# Altium project SENSOR.PrjPcb
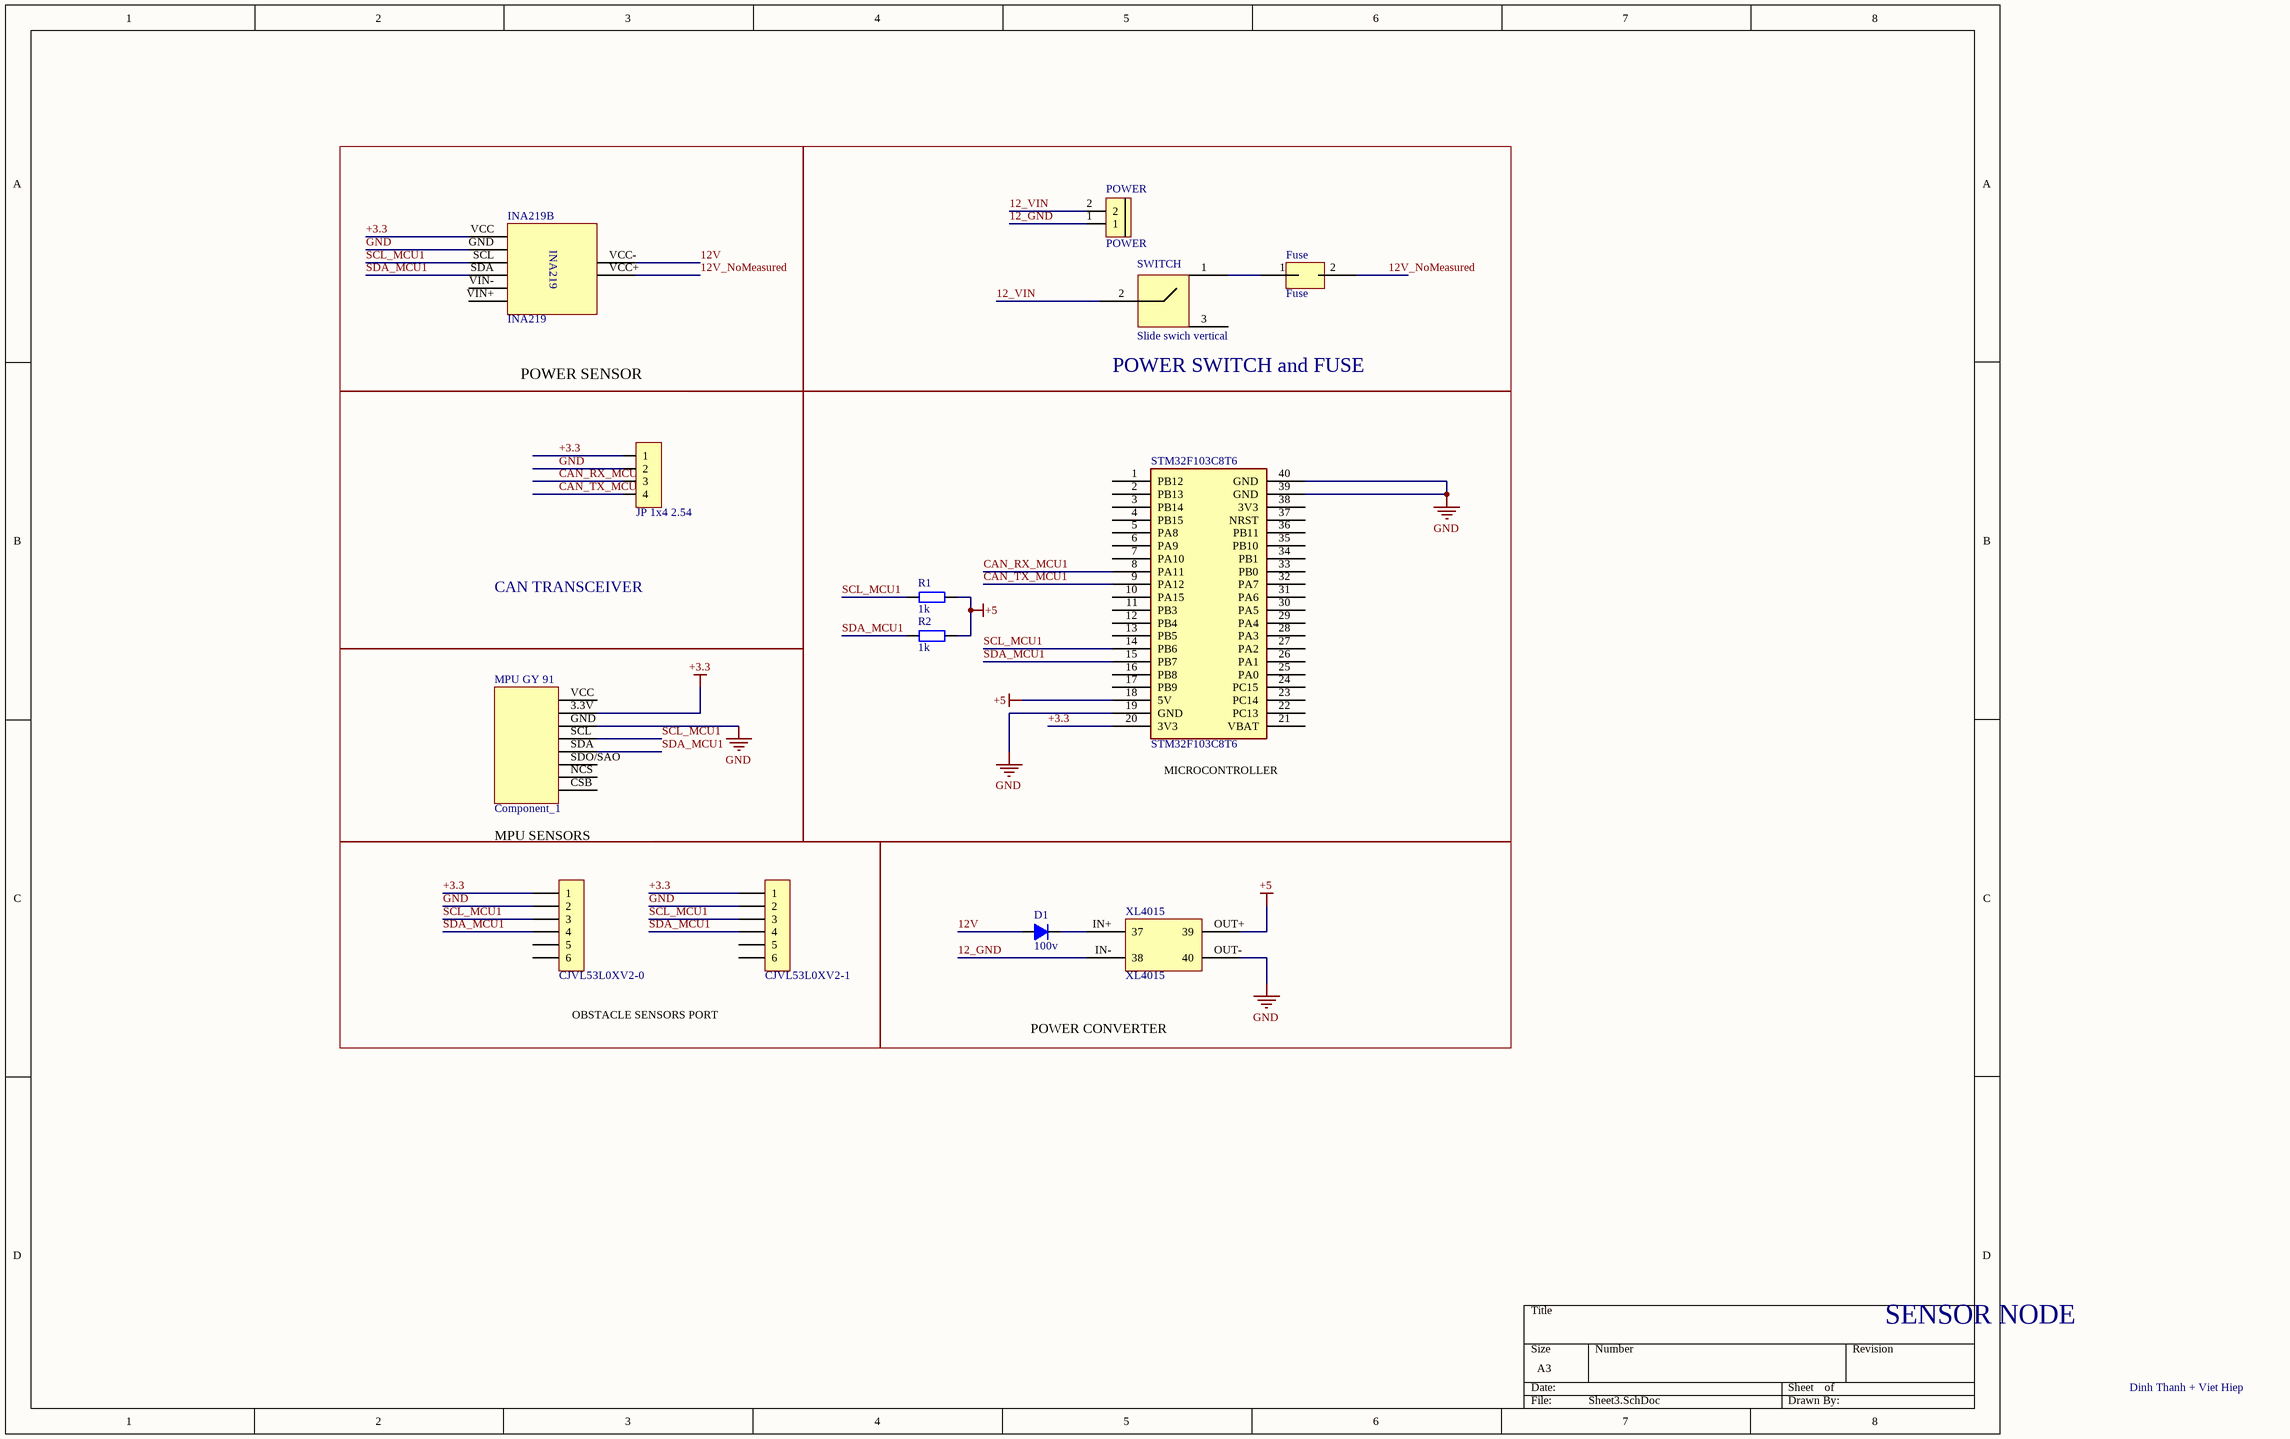
[diagram p0: Sheet3.SchDoc]
1 sheet, 13 parts. Net scope: global (net labels, ports and power ports of the same name join across sheets).
Board file: PCB1.PcbDoc

## Sheet Sheet3.SchDoc
size A3; SheetNumber: 1; SheetTotal: 1

### Parts
CAN  JP 1x4 2.54  [JP 1x4 CC]
CJVL53L0XV2-0  CJVL53L0XV2-0  [XH2.54M-6]
CJVL53L0XV2-1  CJVL53L0XV2-1  [XH2.54M-6]
D1  100v  [DIODE 1A]
Fuse  Fuse  [Fuse3]
INA219  INA219  [INA219]  (part B of 2)
MPU_GY_91  Component_1  [MPU GY 91]
POWER  POWER  [Con 2 KF301 5.08]
R1  1k  [RES-SMD-1210]
R2  1k  [RES-SMD-1210]
STM32F103C8T6  STM32F103C8T6  [Stm32 BluePill]
SWITCH  Slide swich vertical  [SW102T]
XL4015  XL4015  [XL4015]

### Blocks framed on the sheet
POWER SWITCH and FUSE: Fuse POWER SWITCH
CAN TRANSCEIVER: CAN

### Nets
+3.3: CAN.1 CJVL53L0XV2-0.1 CJVL53L0XV2-1.1 INA219.VCC MPU_GY_91.3.3V STM32F103C8T6.20(3V3)
+5: R1.2 R2.2 STM32F103C8T6.18(5V) XL4015.OUT+(39)
GND: CAN.2 CJVL53L0XV2-0.2 CJVL53L0XV2-1.2 INA219.GND MPU_GY_91.GND STM32F103C8T6.19(GND) STM32F103C8T6.39(GND) STM32F103C8T6.40(GND) XL4015.OUT-(40)
12_GND: POWER.1 XL4015.IN-(38)
12_VIN: POWER.2 SWITCH.2
12V: D1.1(A) INA219.VCC-(VIN-)
12V_NoMeasured: Fuse.2 INA219.VCC+
CAN_RX_MCU1: CAN.3 STM32F103C8T6.8(PA11)
CAN_TX_MCU1: CAN.4 STM32F103C8T6.9(PA12)
SCL_MCU1: CJVL53L0XV2-0.3 CJVL53L0XV2-1.3 INA219.SCL MPU_GY_91.SCL R1.1 STM32F103C8T6.14(PB6)
SDA_MCU1: CJVL53L0XV2-0.4 CJVL53L0XV2-1.4 INA219.SDA MPU_GY_91.SDA R2.1 STM32F103C8T6.15(PB7)
NetD1_2: D1.2(K) XL4015.IN+(37)
NetFuse_1: Fuse.1 SWITCH.1

Not connected (* = marked no-connect by the designer): CJVL53L0XV2-0 5 6; CJVL53L0XV2-1 5 6; INA219 VIN+(55) VIN-(54); MPU_GY_91 CSB NCS SDO/SAO VCC; STM32F103C8T6 1(PB12) 2(PB13) 3(PB14) 4(PB15) 5(PA8) 6(PA9) 7(PA10) 10(PA15) 11(PB3) 12(PB4) 13(PB5) 16(PB8) 17(PB9) 21(VBAT) 22(PC13) 23(PC14) 24(PC15) 25(PA0) 26(PA1) 27(PA2) 28(PA3) 29(PA4) 30(PA5) 31(PA6) 32(PA7) 33(PB0) 34(PB1) 35(PB10) 36(PB11) 37(NRST) 38(3V3); SWITCH 3(43)

### Notes on the sheet
- POWER SENSOR
- (near STM32F103C8T6) MICROCONTROLLER
- MPU SENSORS
- OBSTACLE SENSORS PORT
- POWER CONVERTER
- SENSOR NODE
- Dinh Thanh + Viet Hiep

### Library data of the parts
CAN = JP 1x4 2.54 Cai Cong: Cắm; Ten_Linh_Kien: Jump Đơn Cái 2.54MM 1x40P Cong; Don_Vi: Con; Ma_Hang: MH001265; Ghi_Chu: *; Kieu_Chan: *; Chung_Loai: Cắm
CJVL53L0XV2-0 CJVL53L0XV2-1 = Header 6P 2.54 Duc Thang: Cắm; Ten_Linh_Kien: Header 6P XH2.54-6P Đực Thẳng; Don_Vi: Con; Ma_Hang: MH001972; Chung_Loai: Cắm
D1 = Diode 1N4007: Cắm; Ten_Linh_Kien: Diode 1N4007 1A (DIP); Don_Vi: Con; Ma_Hang: MH001063; Ghi Chu: *; Kieu_Chan: *; Chung_Loai: Cắm
Fuse = Fuse Holder 23mm
POWER = CON 2 KF301: Cắm; Ma_Hang: MH000987; Ten_Linh_Kien: CON 2 KF301-2P 5.08MM Xanh Dương; Don_Vi: Con; Chung_Loai: Cắm; Ghi_Chu: *; Kieu_Chan: *
R1 R2 = R: Resistor R1/4W
STM32F103C8T6 = BluePill: Designed By @Alixahedi